# Altium schematic sheet Sheet1.SchDoc: Parachute_Deploy_Top
size Letter; Revision: 1.1; SheetNumber: 1; SheetTotal: 2
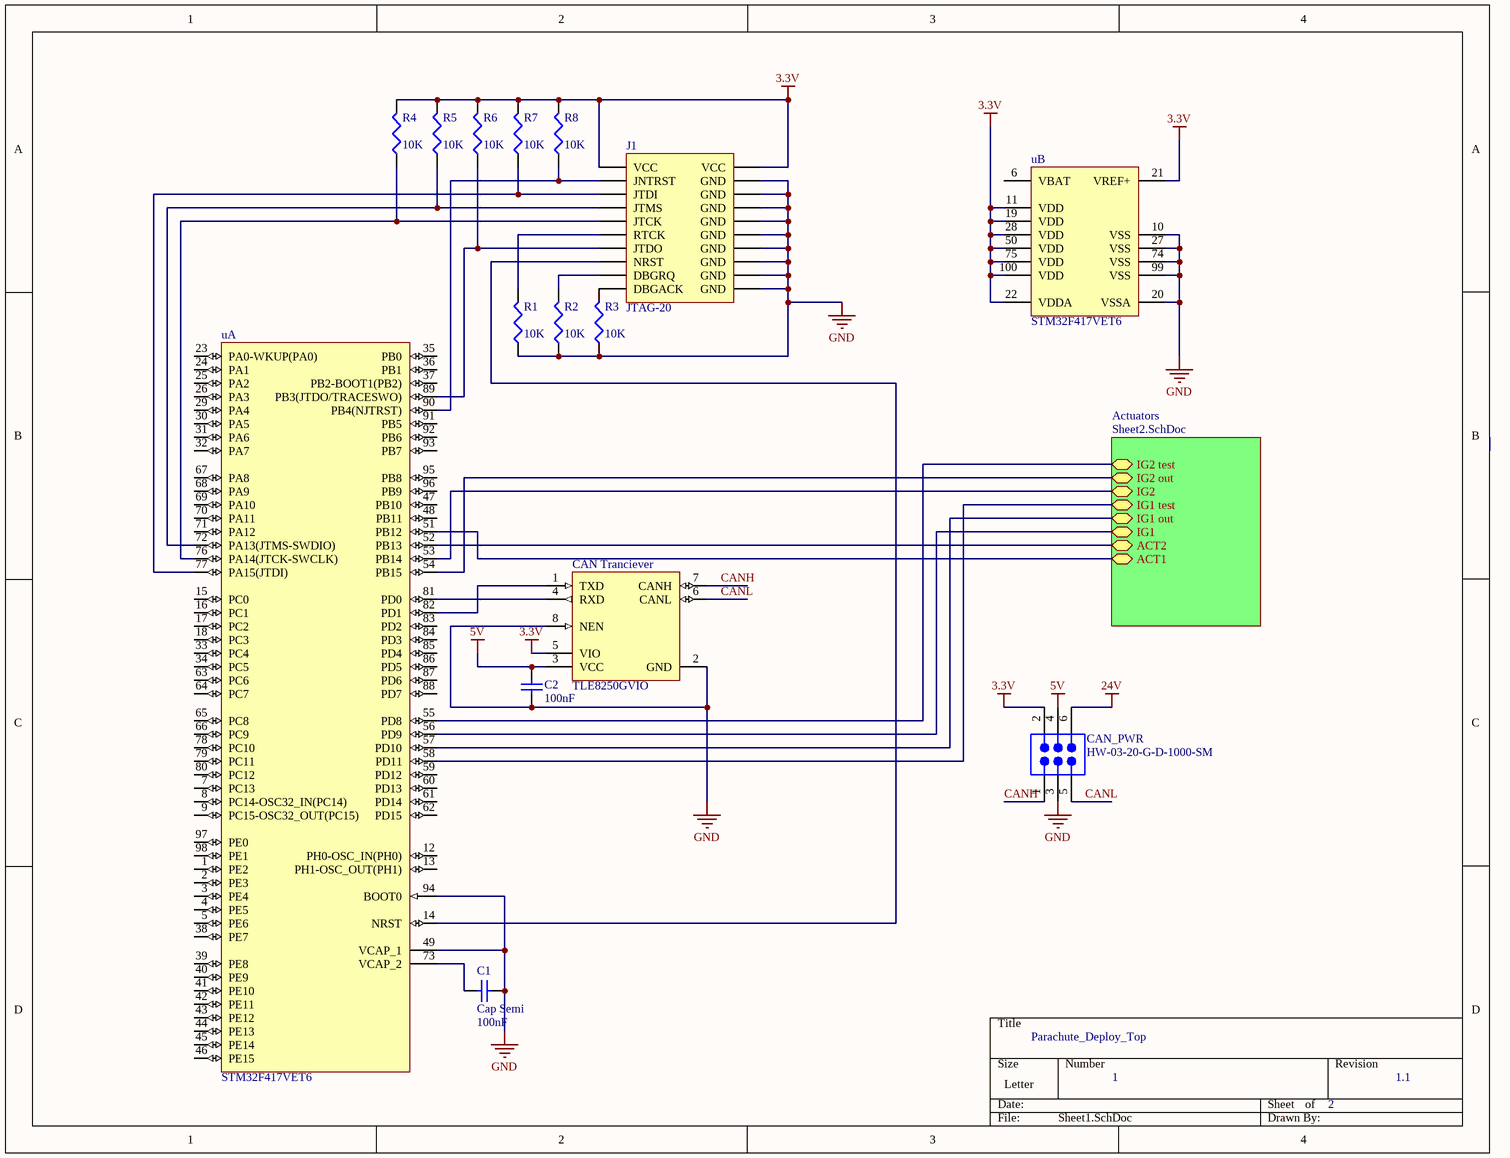
[diagram p0: Sheet1.SchDoc]

## Parts
C1  Cap Semi  value 100nF  [C1206]
C2  value 100nF  [C1206]  (hidden comment: Cap Semi)
CAN_PWR  HW-03-20-G-D-1000-SM  [SMTC-HW-03-20-X-D-1000-SM]
CAN_Tranciever  TLE8250GVIO  [INF-PG-DSO-8-16_N]
J1  JTAG-20  [PCBComponent_1]
R1  value 10K  [J1-0603]  (hidden comment: RTCK PD)
R2  value 10K  [J1-0603]  (hidden comment: DBGRQ PD)
R3  value 10K  [J1-0603]  (hidden comment: DBGACK PD)
R4  value 10K  [J1-0603]  (hidden comment: RTCK PD)
R5  value 10K  [J1-0603]  (hidden comment: RTCK PD)
R6  value 10K  [J1-0603]  (hidden comment: RTCK PD)
R7  value 10K  [J1-0603]  (hidden comment: RTCK PD)
R8  value 10K  [J1-0603]  (hidden comment: RTCK PD)
u  STM32F417VET6  [STM-LQFP100_N]  (parts A,B of 2)

## Sub-sheets
Actuators = Sheet2.SchDoc: IG1 out (bidir), IG1 test (bidir), IG2 (bidir), IG2 test (bidir), IG2 out (bidir), IG1 (bidir), ACT2 (bidir), ACT1 (bidir)

## Nets
3.3V: CAN_PWR.2 CAN_Tranciever.5(VIO) J1.1(VCC) J1.2(VCC) R4.2 R5.2 R6.2 R7.2 R8.2 u.11(VDD) u.19(VDD) u.21(VREF+) u.22(VDDA) u.28(VDD) u.50(VDD) u.75(VDD) u.100(VDD)
5V: C2.2 CAN_PWR.4 CAN_Tranciever.3(VCC)
24V: CAN_PWR.6
GND: C1.2 C2.1 CAN_PWR.3 CAN_Tranciever.2(GND) CAN_Tranciever.8(NEN) J1.4(GND) J1.6(GND) J1.8(GND) J1.10(GND) J1.12(GND) J1.14(GND) J1.16(GND) J1.18(GND) J1.20(GND) R1.1 R2.1 R3.1 u.10(VSS) u.20(VSSA) u.27(VSS) u.49(VCAP_1) u.74(VSS) u.94(BOOT0) u.99(VSS)
CANH: CAN_PWR.1 CAN_Tranciever.7(CANH)
CANL: CAN_PWR.5 CAN_Tranciever.6(CANL)
NetC1_1: C1.1 u.73(VCAP_2)
NetCAN_Tranciever_1: CAN_Tranciever.1(TXD) u.82(PD1)
NetCAN_Tranciever_4: CAN_Tranciever.4(RXD) u.81(PD0)
NetJ1_3: J1.3(JNTRST) R8.1 u.90(PB4(NJTRST))
NetJ1_5: J1.5(JTDI) R7.1 u.77(PA15(JTDI))
NetJ1_7: J1.7(JTMS) R5.1 u.72(PA13(JTMS-SWDIO))
NetJ1_9: J1.9(JTCK) R4.1 u.76(PA14(JTCK-SWCLK))
NetJ1_11: J1.11(RTCK) R1.2
NetJ1_13: J1.13(JTDO) R6.1 u.89(PB3(JTDO/TRACESWO))
NetJ1_15: J1.15(NRST) u.14(NRST)
NetJ1_17: J1.17(DBGRQ) R2.2
NetJ1_19: J1.19(DBGACK) R3.2
Netu_51: u.51(PB12) ; sheet Actuators/ACT1
Netu_52: u.52(PB13) ; sheet Actuators/ACT2
Netu_53: u.53(PB14) ; sheet Actuators/IG2
Netu_54: u.54(PB15) ; sheet Actuators/IG2 out
Netu_55: u.55(PD8) ; sheet Actuators/IG2 test
Netu_56: u.56(PD9) ; sheet Actuators/IG1
Netu_57: u.57(PD10) ; sheet Actuators/IG1 out
Netu_58: u.58(PD11) ; sheet Actuators/IG1 test

Not connected (* = marked no-connect by the designer): u 1(PE2) 2(PE3) 3(PE4) 4(PE5) 5(PE6) 6(VBAT) 7(PC13) 8(PC14-OSC32_IN(PC14)) 9(PC15-OSC32_OUT(PC15)) 12(PH0-OSC_IN(PH0)) 13(PH1-OSC_OUT(PH1)) 15(PC0) 16(PC1) 17(PC2) 18(PC3) 23(PA0-WKUP(PA0)) 24(PA1) 25(PA2) 26(PA3) 29(PA4) 30(PA5) 31(PA6) 32(PA7) 33(PC4) 34(PC5) 35(PB0) 36(PB1) 37(PB2-BOOT1(PB2)) 38(PE7) 39(PE8) 40(PE9) 41(PE10) 42(PE11) 43(PE12) 44(PE13) 45(PE14) 46(PE15) 47(PB10) 48(PB11) 59(PD12) 60(PD13) 61(PD14) 62(PD15) 63(PC6) 64(PC7) 65(PC8) 66(PC9) 67(PA8) 68(PA9) 69(PA10) 70(PA11) 71(PA12) 78(PC10) 79(PC11) 80(PC12) 83(PD2) 84(PD3) 85(PD4) 86(PD5) 87(PD6) 88(PD7) 91(PB5) 92(PB6) 93(PB7) 95(PB8) 96(PB9) 97(PE0) 98(PE1)

## Library data of the parts
C1 C2 = Cap Semi: Capacitor (Semiconductor SIM Model); Published: 8-Jun-2000; LatestRevisionDate: 29-May-2009; LatestRevisionNote: IPC-7351 Footprint Added.; PackageReference: C1206; Publisher: Altium Limited; PackageDescription: Chip Capacitor
CAN_PWR = HW-03-20-G-D-1000-SM: Flexible .025" SQ Board Stacker, Surface Mount, Vertical, -55 to 125 degC, 2.54 mm Pitch, 6-Pin, Male, RoHS; Manufacturer: Samtec; Pitch: 2.54 mm; DatasheetVersion: F-214; PackageVersion: AW, 3/1993; PackageReference: HW-03-20-X-D-1000-SM; PackageDescription: HW Board to Board Assembly; Orientation: Vertical; RoHS: True; Temperature Range: -55 to 125 degC; Mounting Technology: Surface Mount; PartNumber: HW-03-20-G-D-1000-SM; ComponentLink1Description: Datasheet; ComponentLink1URL: http://www.samtec.com/documents/webfiles/pdf/HW_SM.PDF; ComponentLink2Description: Package Specification; ComponentLink2URL: http://www.samtec.com/documents/webfiles/cpdf/HW-XX-XX-XX-X-XXXX-SM-X-XXX-MKT.pdf
CAN_Tranciever = TLE8250GVIO: High Speed CAN-Transceiver, 1 Mbit/s Transmission Rate, PG-DSO-8-16, Reel, Green; Manufacturer: Infineon; Bus Wake-up capability: FALSE; Green: TRUE; Quiescent Current (max.): < 15 uA @ 5V standby; Standards: ISO11898-2; Wake-up inputs: no; DatasheetVersion: Rev. 1.0; PackageVersion: Mar-07; PackageReference: PG-DSO-8-16; PackageDescription: 8-Pin Plastic (Green) Dual Small Outline Package, 4.9 x 3.9 mm Body, 1.27 mm Pitch; Supplier 1: Mouser; Supplier Part Number 1: 726-TLE8250GVIO; Supplier 2: Digi-Key; Supplier Part Number 2: TLE8250GVIO-ND; Group: High Speed; Halogen-free: TRUE; Packing: Reel; Transmission rate max: 1 Mbit/s; Mounting Technology: Surface Mount; PartNumber: TLE8250GVIO; ComponentLink1Description: Manufacturer URL; ComponentLink1URL: http://www.infineon.com/; ComponentLink2Description: Datasheet; ComponentLink2URL: http://www.infineon.com/dgdl/TLE8250GVIO_DS_Rev10.pdf?folderId=db3a30431ed1d7b2011edadb13813703&fileId=db3a30432b57a660012b67ea91880b46&location=en.Products.Automotive_ICs.Automotive_Transceivers.CAN_Transceivers.DATASHEET.TLE8250GVIO_DS_Rev10.pdf; ComponentLink3Description: Package Specification; ComponentLink3URL: http://www.infineon.com/dgdl/TLE7259-2GE_DS_rev12.pdf?folderId=db3a3043163797a6011666d32a0c0de1&fileId=db3a3043163797a6011666d4dbb80de2&location=en.Products.Automotive_ICs.Automotive_Transceivers.LIN_Transceivers.DATASHEET.TLE7259-2GE_DS_rev12.pdf
J1 = HEADER 10X2: 20-pin JTAG header
R1-R8 = Res3: Resistor; Published: 8-Jun-2000; LatestRevisionDate: 29-May-2009; LatestRevisionNote: IPC-7351 Footprint Added.; PackageReference: J1-0603; Publisher: Altium Limited; PackageDescription: Chip Resistor
u = STM32F417VET6: ARM Cortex-M4 32-bit MCU+FPU, 210 DMIPS, 512 kB Flash, 192 kB Internal RAM, 82 I/Os, 100-pin LQFP, -40 to 85 degC, Tray; Manufacturer: STMicroelectronics; D/A Converter: 2x12-bit; FLASH Size (Prog) (kB): 512; I/Os (High Current): 82; Internal RAM Size (kB): 192; Operating Frequency(F) (Processor speed) (MHz): 168; Supply Voltage(Vcc) max (V): 3.6; Supply Voltage(Vcc) min (V): 1.8; DatasheetVersion: Rev. 4; PackageVersion: Rev. 1, 06/2013; PackageReference: LQFP100; PackageDescription: 100-Pin Low Profile Quad Flat Package, 14 x 14 mm Body, 0.5 mm Pitch; Supplier 1: Digi-Key; Supplier Part Number 1: 497-11901-ND; Supplier 2: Farnell; Supplier Part Number 2: 2333307; Supplier 3: Newark; Supplier Part Number 3: 99W9922; Supplier 4: Newark; Supplier Part Number 4: 94T6496; Supplier 5: Mouser; Supplier Part Number 5: 511-STM32F417VET6; Core: ARM Cortex-M4; Packing: Tray; Mounting Technology: Surface Mount; PartNumber: STM32F417VET6; ComponentLink1Description: Manufacturer URL; ComponentLink1URL: http://www.st.com/web/en/home.html; ComponentLink2Description: Datasheet; ComponentLink2URL: http://www.st.com/st-web-ui/static/active/en/resource/technical/document/datasheet/DM00035129.pdf; ComponentLink3Description: Package Specification; ComponentLink3URL: http://www.st.com/st-web-ui/static/active/en/resource/technical/document/data_brief/DM00071938.pdf